# EAGLE design numpad (EAGLE 9.6.2)
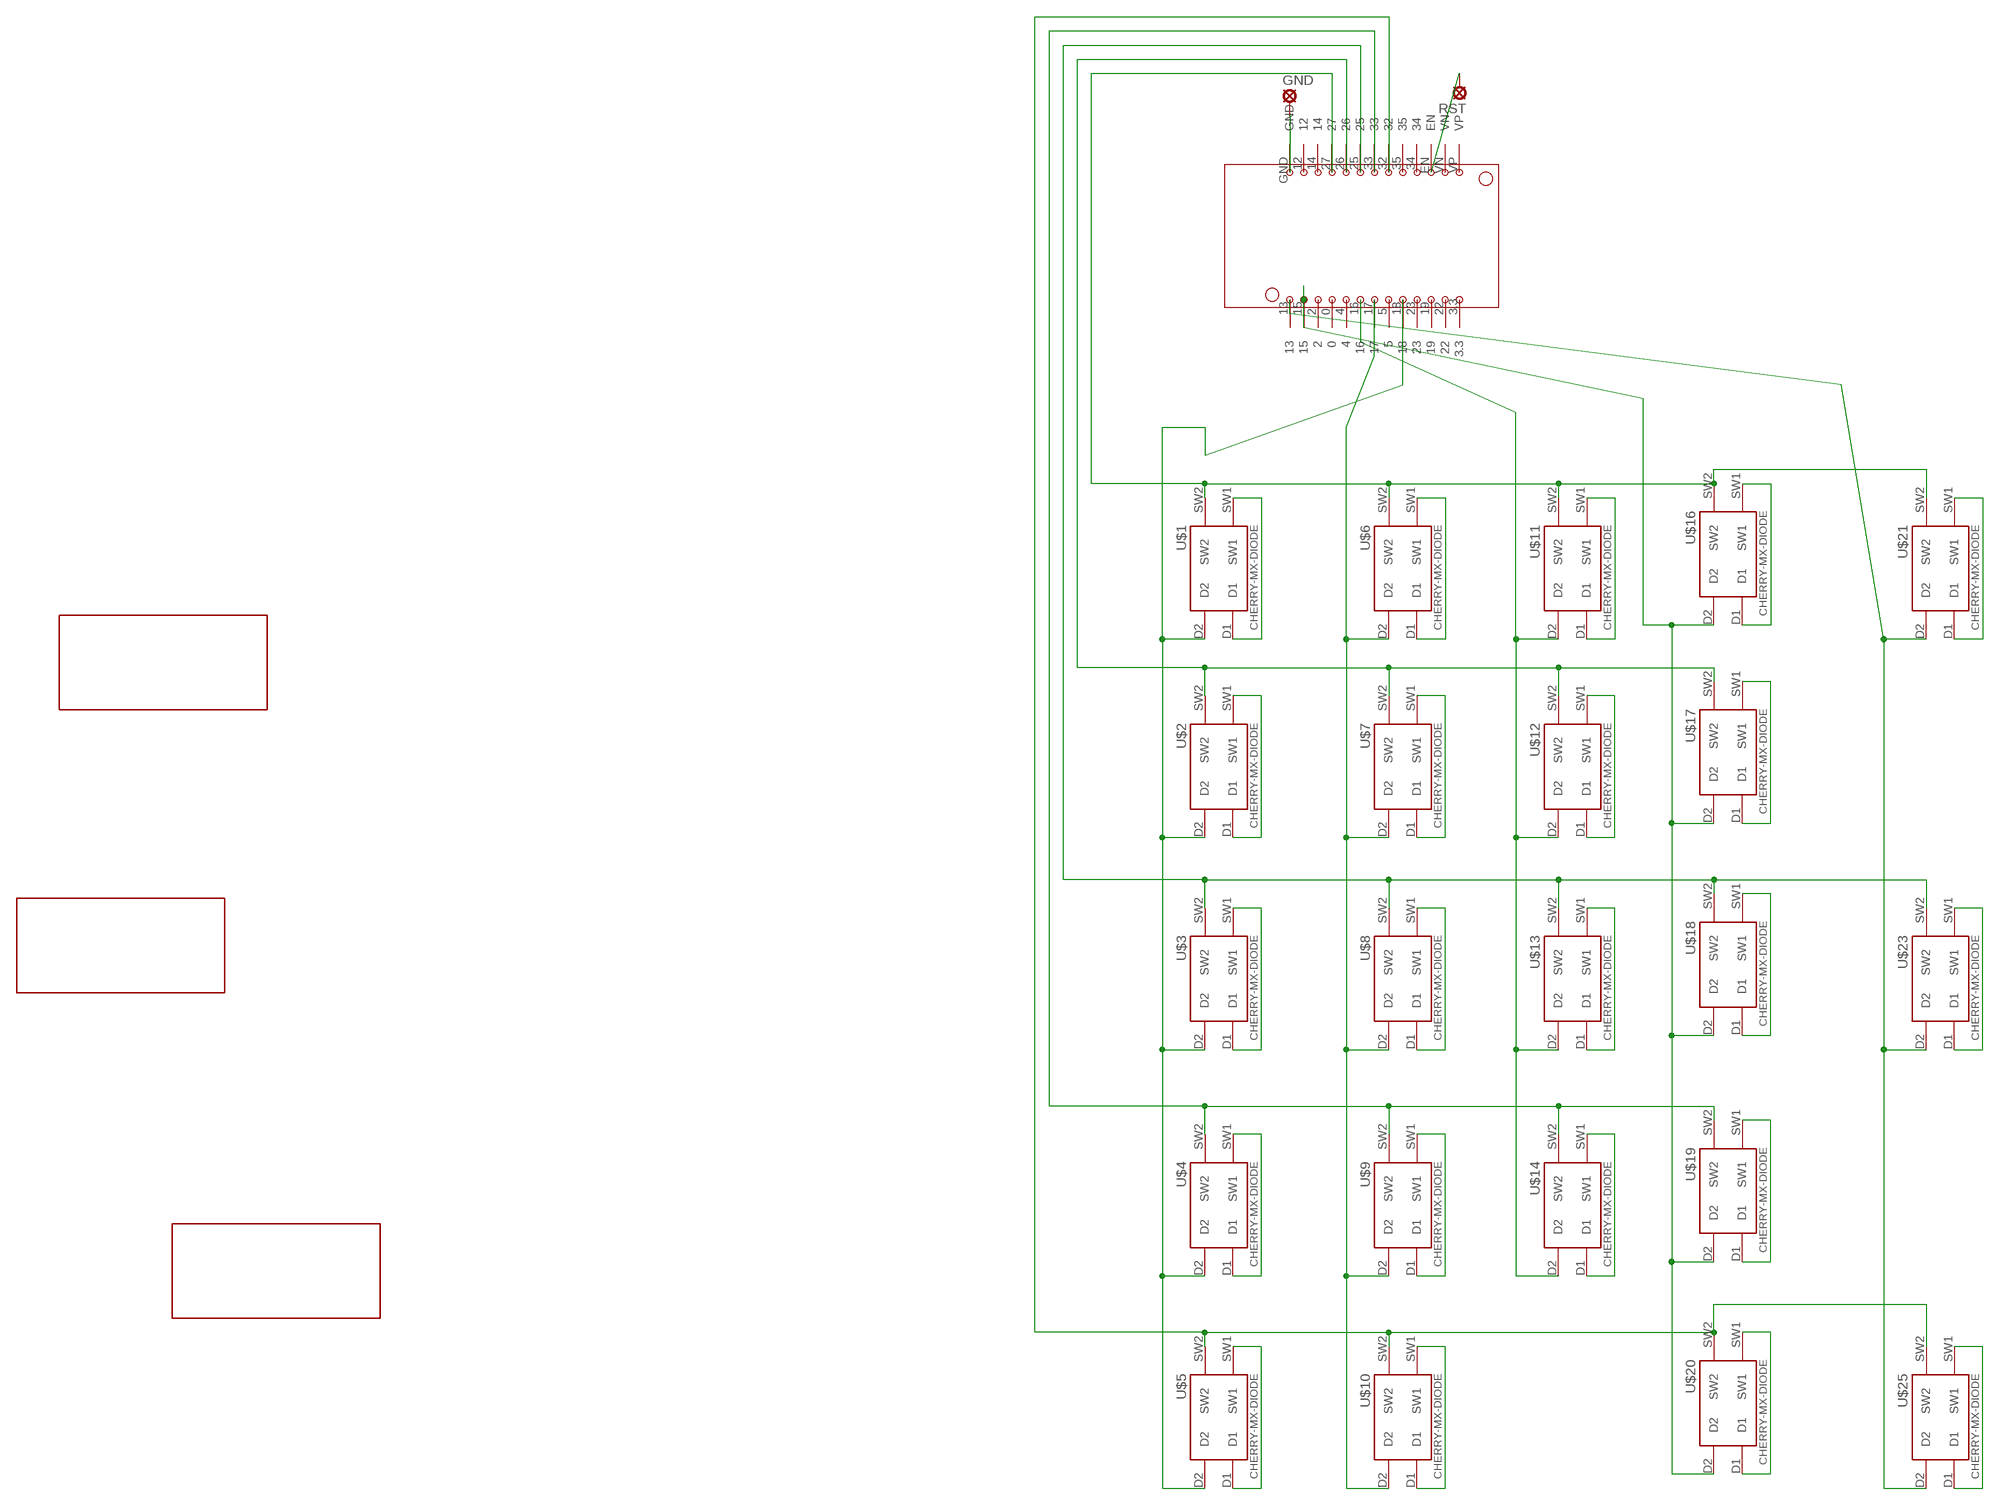
[diagram p0: schematic, sheet 1]

## Parts
GND  LSP10  [LSP10]
RST  LSP10  [LSP10]
U$1  CHERRY-MX-DIODE  [CHERRY-MX-DIODE]
U$2  CHERRY-MX-DIODE  [CHERRY-MX-DIODE]
U$3  CHERRY-MX-DIODE  [CHERRY-MX-DIODE]
U$4  CHERRY-MX-DIODE  [CHERRY-MX-DIODE]
U$5  CHERRY-MX-DIODE  [CHERRY-MX-DIODE]
U$6  CHERRY-MX-DIODE  [CHERRY-MX-DIODE]
U$7  CHERRY-MX-DIODE  [CHERRY-MX-DIODE]
U$8  CHERRY-MX-DIODE  [CHERRY-MX-DIODE]
U$9  CHERRY-MX-DIODE  [CHERRY-MX-DIODE]
U$10  CHERRY-MX-DIODE  [CHERRY-MX-DIODE]
U$11  CHERRY-MX-DIODE  [CHERRY-MX-DIODE]
U$12  CHERRY-MX-DIODE  [CHERRY-MX-DIODE]
U$13  CHERRY-MX-DIODE  [CHERRY-MX-DIODE]
U$14  CHERRY-MX-DIODE  [CHERRY-MX-DIODE]
U$15  2U  [2U]
U$16  CHERRY-MX-DIODE  [CHERRY-MX-DIODE]
U$17  CHERRY-MX-DIODE  [CHERRY-MX-DIODE]
U$18  CHERRY-MX-DIODE  [CHERRY-MX-DIODE]
U$19  CHERRY-MX-DIODE  [CHERRY-MX-DIODE]
U$20  CHERRY-MX-DIODE  [CHERRY-MX-DIODE]
U$21  CHERRY-MX-DIODE  [CHERRY-MX-DIODE]
U$22  2U  [2U]
U$23  CHERRY-MX-DIODE  [CHERRY-MX-DIODE]
U$24  2U  [2U]
U$25  CHERRY-MX-DIODE  [CHERRY-MX-DIODE]
U$27  ESP32OFFBRAND  [ESP32OFFBRAND]

## Nets
N$1: U$1.D1 U$1.SW1
N$2: U$2.D1 U$2.SW1
N$3: U$3.D1 U$3.SW1
N$4: U$4.D1 U$4.SW1
N$5: U$5.D1 U$5.SW1
N$6: U$6.D1 U$6.SW1
N$7: U$7.D1 U$7.SW1
N$8: U$8.D1 U$8.SW1
N$9: U$9.D1 U$9.SW1
N$10: U$10.D1 U$10.SW1
N$11: U$6.D2 U$7.D2 U$8.D2 U$9.D2 U$10.D2 U$27.17
N$12: U$11.D1 U$11.SW1
N$13: U$12.D1 U$12.SW1
N$14: U$13.D1 U$13.SW1
N$15: U$14.D1 U$14.SW1
N$17: U$11.D2 U$12.D2 U$13.D2 U$14.D2 U$27.16
N$18: U$16.D1 U$16.SW1
N$19: U$17.D1 U$17.SW1
N$20: U$18.D1 U$18.SW1
N$21: U$19.D1 U$19.SW1
N$22: U$20.D1 U$20.SW1
N$23: U$16.D2 U$17.D2 U$18.D2 U$19.D2 U$20.D2 U$27.15
N$24: U$21.D1 U$21.SW1
N$26: U$23.D1 U$23.SW1
N$28: U$25.D1 U$25.SW1
N$29: U$21.D2 U$23.D2 U$25.D2 U$27.13
N$30: U$1.SW2 U$6.SW2 U$11.SW2 U$16.SW2 U$21.SW2 U$27.27
N$31: U$2.SW2 U$7.SW2 U$12.SW2 U$17.SW2 U$27.26
N$32: U$3.SW2 U$8.SW2 U$13.SW2 U$18.SW2 U$23.SW2 U$27.25
N$33: U$4.SW2 U$9.SW2 U$14.SW2 U$19.SW2 U$27.33
N$34: U$5.SW2 U$10.SW2 U$20.SW2 U$25.SW2 U$27.32
N$36: U$1.D2 U$2.D2 U$3.D2 U$4.D2 U$5.D2 U$27.18
N$38: GND.MP U$27.GND
N$39: RST.MP U$27.EN
Unconnected: U$27.0 U$27.2 U$27.3.3 U$27.4 U$27.5 U$27.12 U$27.14 U$27.19 U$27.22 U$27.23 U$27.34 U$27.35 U$27.VN U$27.VP

## Library data of the parts
GND RST = solpad:LSP10: SOLDER PAD drill 1.0 mm, distributor Buerklin, 12H555
U$1-U$14 U$16-U$21 U$23 U$25 = cherrymx:CHERRY-MX-DIODE: Cherry MX series keyswitch with diode bridge
U$15 U$22 U$24 = Cherry 2u stab:2U
U$27 = ESP32:ESP32OFFBRAND

## Board
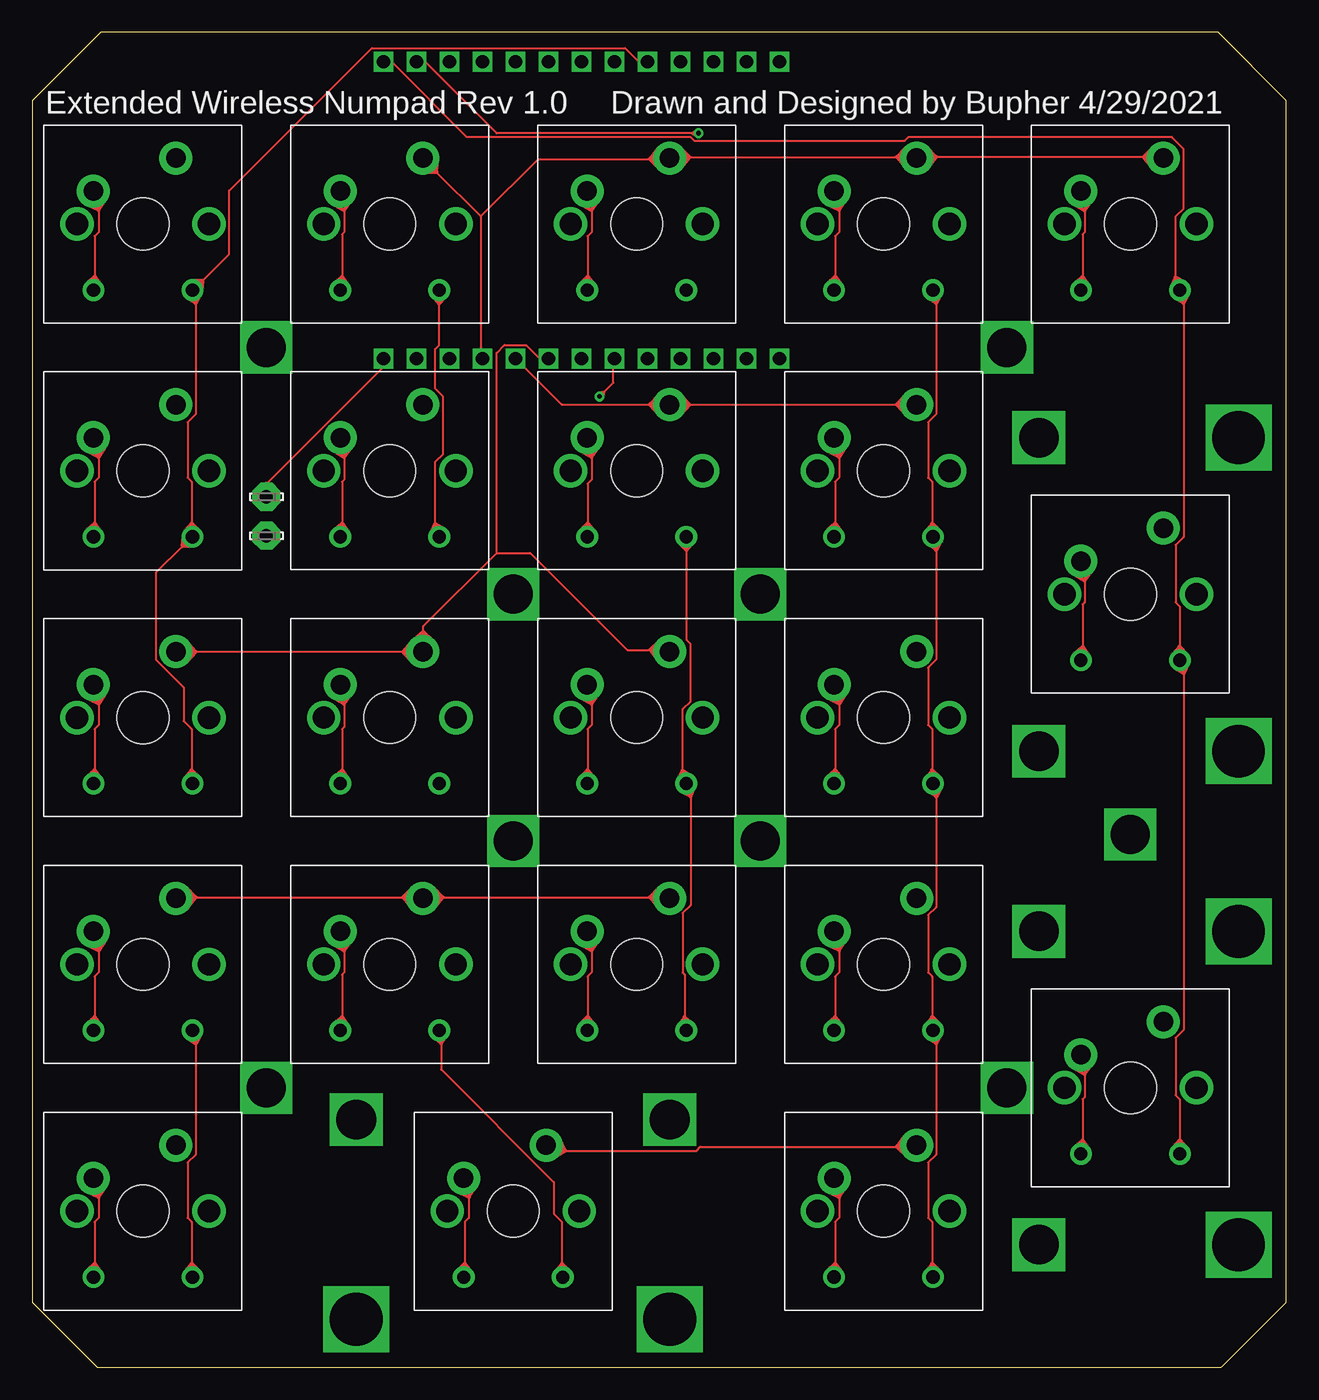
[diagram p1: board, top side]
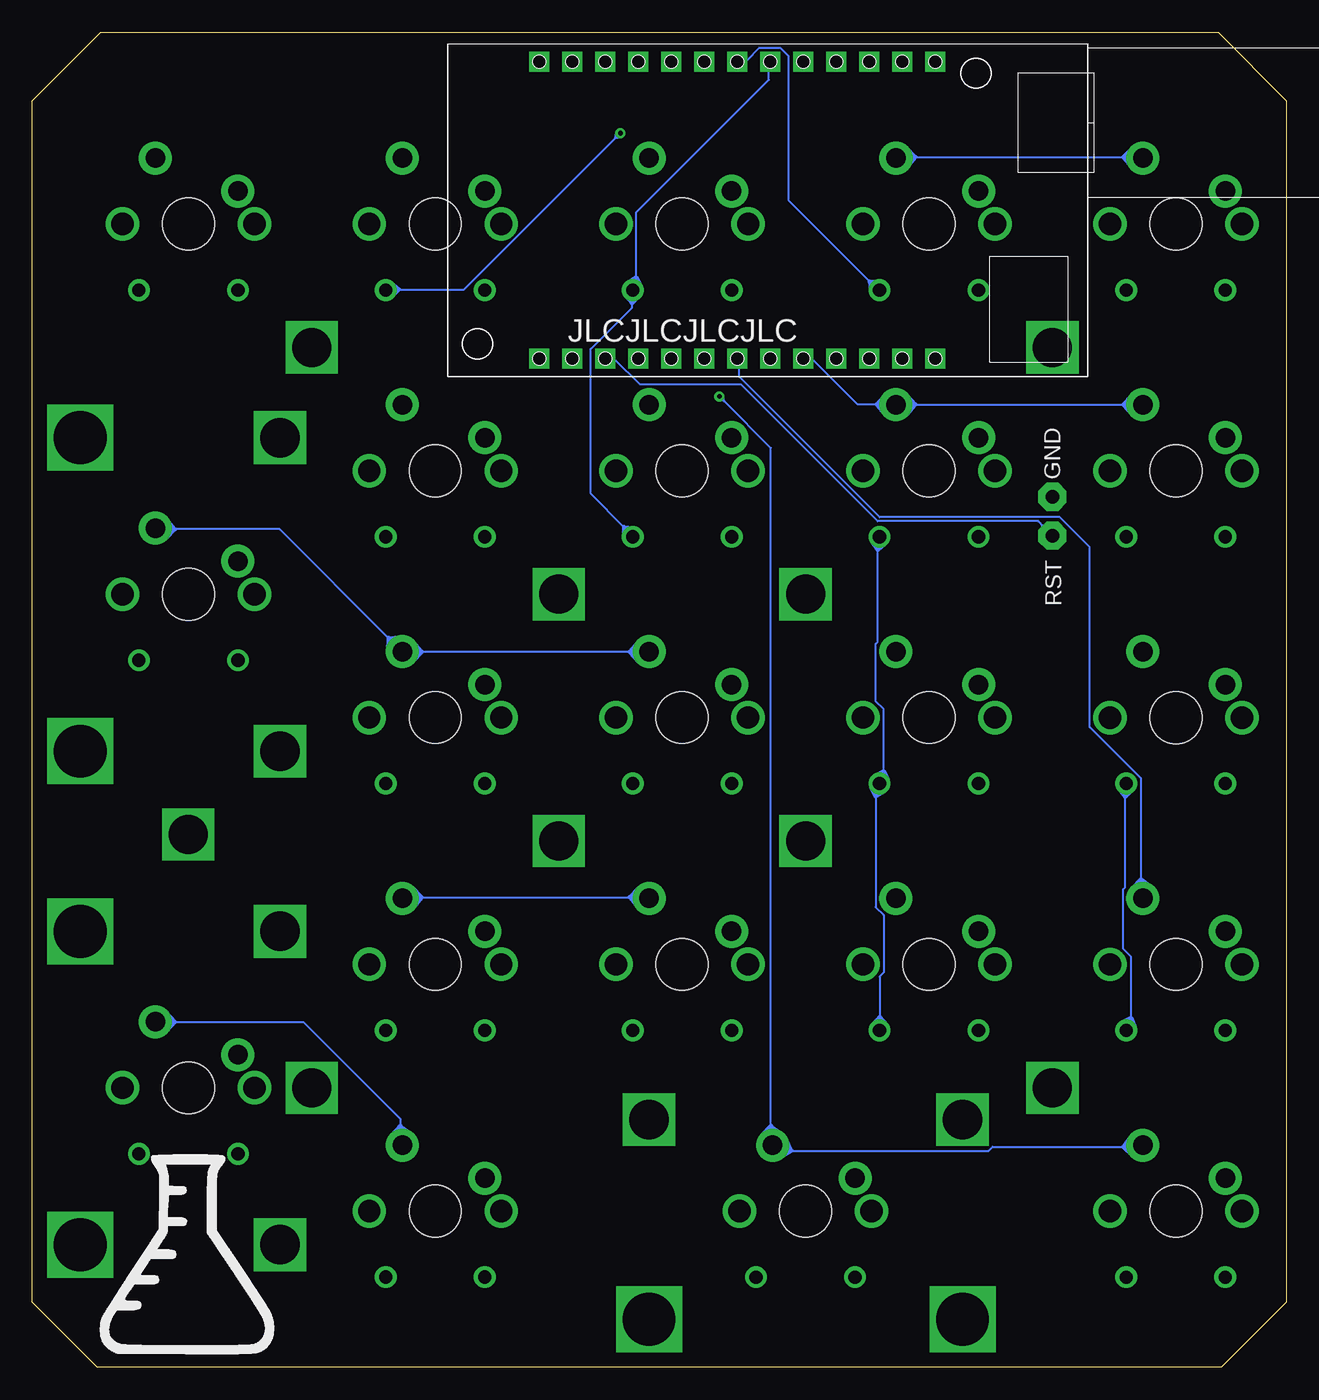
[diagram p2: board, bottom side, seen from below]

Size 96.5 x 102.75 mm. Coordinates in mm from the lower left corner, seen from the top.
Outline: 5,0 91.5,0 96.5,5 96.5,97.5 91.25,102.75 5.25,102.75 0,97.5 0,5 5,0
Copper layers (1*16): Top 0.035mm / dielectric 1.5mm / Bottom 0.035mm
Design rules "default": minimum track width 6mil, minimum drill 0.35mm, track to track 6mil, track to pad 6mil, pad to pad 6mil, via to via 6mil, smd to smd 6mil, copper to edge 40mil, drill to drill 6mil, minimum pad ring 10mil, minimum via ring 8mil, stop-mask expansion 4mil, vias tented up to drill 0mil, thermal gap 10mil

### Footprints (pad centres in the part's own frame; a part is rotated, then mirrored left to right if it is on the bottom)
LSP10 = drill 1.016 pad 2.159 octagon: MP 0,0
CHERRY-MX-DIODE = drill 1.016 pad 1.676: D1 -3.81,-5.08; D2 3.81,-5.08 | drill 1.714 pad 1.93: P$3 -5.08,0; P$4 5.08,0 | drill 1.5 pad 2.54: SW1 -3.81,2.54; SW2 2.54,5.08 | hole 4: 0,0
2U = drill 3.048 square: P$1 -12.082,7.044; P$3 12.048,7.044 | drill 4.064 square: P$2 -12.082,-8.323; P$4 12.048,-8.323
ESP32OFFBRAND = drill 1.016 square: 0 0,22.86; 2 0,25.4; 3.3 0,0; 4 0,20.32; 5 0,12.7; 12 22.86,27.94; 13 0,30.48; 14 22.86,25.4; 15 0,27.94; 16 0,17.78; 17 0,15.24; 18 0,10.16; 19 0,5.08; 22 0,2.54; 23 0,7.62; 25 22.86,17.78; 26 22.86,20.32; 27 22.86,22.86; 32 22.86,12.7; 33 22.86,15.24; 34 22.86,7.62; 35 22.86,10.16; EN 22.86,5.08; GND 22.86,30.48; VN 22.86,2.54; VP 22.86,0

### Placement (x,y rotation side)
GND  18,67 0 top
RST  18,64 0 top
U$1  8.5,88 0 top
U$2  8.5,69 0 top
U$3  8.5,50 0 top
U$4  8.5,31 0 top
U$5  8.5,12 0 top
U$6  27.5,88 0 top
U$7  27.5,69 0 top
U$8  27.5,50 0 top
U$9  27.5,31.01 0 top
U$10  37,12 0 top
U$11  46.5,88 0 top
U$12  46.5,69 0 top
U$13  46.5,50 0 top
U$14  46.5,31.01 0 top
U$15  37,12 0 top
U$16  65.5,88 0 top
U$17  65.5,69 0 top
U$18  65.5,50 0 top
U$19  65.5,31.01 0 top
U$20  65.5,12 0 top
U$21  84.5,88 0 top
U$22  84.5,21.5 90 top
U$23  84.5,59.5 0 top
U$24  84.5,59.5 90 top
U$25  84.5,21.5 0 top
U$27  57.5,100.5 270 bottom

### Tracks (layer width: path | path; a pad name or v marks a point on that pad's centre or on a via)
N$1
  Top 0.152: U$1.D1 4.78,82.95 4.78,83.93 4.78,87.07 5.08,87.37 5.08,89.09 5.08,90.12 4.78,90.42 U$1.SW1
  Top 0.305: 5.08,89.09 5.63,89.93 U$1.SW1 4.19,89.54 5.08,89.09 | 4.78,83.93 4.23,83.42 U$1.D1 5.23,83.34 4.78,83.93
N$2
  Top 0.152: U$2.D1 4.78,64.06 4.78,64.93 4.78,68.17 5.08,68.48 5.08,70.09 5.08,71.22 4.78,71.52 U$2.SW1
  Top 0.305: 4.78,64.93 4.23,64.42 U$2.D1 5.23,64.34 4.78,64.93 | 5.08,70.09 5.63,70.93 U$2.SW1 4.19,70.54 5.08,70.09
N$3
  Top 0.152: U$3.D1 4.78,45.01 4.78,45.93 4.78,49.12 5.08,49.43 5.08,51.09 5.08,52.17 4.78,52.47 U$3.SW1
  Top 0.305: 4.78,45.93 4.23,45.42 U$3.D1 5.23,45.34 4.78,45.93 | 5.08,51.09 5.63,51.93 U$3.SW1 4.19,51.54 5.08,51.09
N$4
  Top 0.152: U$4.D1 4.78,25.96 4.78,26.93 4.78,30.07 5.08,30.38 5.08,32.09 5.08,33.12 4.78,33.42 U$4.SW1
  Top 0.305: 4.78,26.93 4.23,26.43 U$4.D1 5.23,26.34 4.78,26.93 | 5.08,32.09 5.63,32.93 U$4.SW1 4.19,32.54 5.08,32.09
N$5
  Top 0.152: U$5.D1 4.78,7.06 4.78,7.93 4.78,11.17 5.08,11.48 5.08,13.09 5.08,14.22 4.78,14.53 U$5.SW1
  Top 0.305: 4.78,7.93 4.23,7.43 U$5.D1 5.23,7.34 4.78,7.93 | 5.08,13.09 5.63,13.93 U$5.SW1 4.19,13.54 5.08,13.09
N$6
  Top 0.152: U$6.D1 23.83,82.95 23.83,83.93 23.83,87.22 23.98,87.37 23.98,89.07 23.98,90.27 23.83,90.42 U$6.SW1
  Top 0.305: 23.98,89.07 24.58,89.87 U$6.SW1 23.12,89.58 23.98,89.07 | 23.83,83.93 23.25,83.45 U$6.D1 24.25,83.31 23.83,83.93
N$7
  Top 0.152: U$7.D1 23.83,64.06 23.83,64.93 23.83,68.17 23.98,68.32 23.98,70.07 23.98,71.37 23.83,71.52 U$7.SW1
  Top 0.305: 23.83,64.93 23.25,64.45 U$7.D1 24.25,64.31 23.83,64.93 | 23.98,70.07 24.58,70.87 U$7.SW1 23.12,70.58 23.98,70.07
N$8
  Top 0.152: U$8.D1 23.83,45.01 23.83,45.93 23.83,49.12 23.98,49.27 23.98,51.07 23.98,52.32 23.83,52.47 U$8.SW1
  Top 0.305: 23.83,45.93 23.25,45.45 U$8.D1 24.25,45.31 23.83,45.93 | 23.98,51.07 24.58,51.87 U$8.SW1 23.12,51.58 23.98,51.07
N$9
  Top 0.152: U$9.D1 23.83,25.96 23.83,26.93 23.83,30.22 23.98,30.38 23.98,32.07 23.98,33.27 23.83,33.42 U$9.SW1
  Top 0.305: 23.83,26.93 23.25,26.45 U$9.D1 24.25,26.32 23.83,26.93 | 23.98,32.07 24.58,32.87 U$9.SW1 23.12,32.59 23.98,32.07
N$10
  Top 0.152: U$10.D1 33.28,7.06 33.28,7.93 33.28,11.17 33.58,11.48 33.58,13.09 33.58,14.22 33.28,14.53 U$10.SW1
  Top 0.305: 33.28,7.93 32.73,7.42 U$10.D1 33.73,7.34 33.28,7.93 | 33.58,13.09 34.13,13.93 U$10.SW1 32.69,13.54 33.58,13.09
N$11
  Top 0.152: U$10.D2 40.74,7.06 40.74,7.93 40.74,11.17 40.13,11.78 40.13,14.22 31.45,22.91 31.45,24.92 31.45,25.8 U$9.D2 | U$6.D2 31.3,82.8 31.3,81.9 31.3,78.69 30.99,78.38 30.99,75.33 31.6,74.72 31.6,70.3 30.99,69.69 30.99,64.89 30.99,64.36 31.3,64.06 U$7.D2
  Top 0.305: 31.3,81.9 31.81,82.45 U$6.D2 30.8,82.47 31.3,81.9 | 30.99,64.89 30.68,64.2 U$7.D2 31.65,64.52 30.99,64.89 | 31.45,24.92 31.87,25.54 U$9.D2 30.87,25.4 31.45,24.92 | 40.74,7.93 40.27,7.35 U$10.D2 41.28,7.41 40.74,7.93
  Bottom 0.152: U$27.17 42.12,100.63 41.51,100.63 40.59,101.55 38.91,101.55 38.31,100.94 38.31,89.81 32.08,83.58 31.45,82.95 U$6.D2 | U$9.D2 31.3,25.96 31.3,26.94 31.3,30.07 30.99,30.38 30.99,34.8 31.6,35.41 31.6,43.95 31.6,44.7 31.45,44.85 U$8.D2 31.3,45.01 30.99,45.31 30.99,45.88 30.99,50.65 31.6,51.25 31.6,55.67 31.45,55.83 31.45,62.92 31.45,63.9 U$7.D2
  Bottom 0.305: U$8.D2 31.93,44.62 31.6,43.95 30.96,44.33 U$8.D2 | U$8.D2 30.68,45.2 30.99,45.88 31.65,45.52 U$8.D2 | 32.08,83.58 31.33,83.61 U$6.D2 31.99,82.84 32.08,83.58 | 31.45,62.92 31.87,63.53 U$7.D2 30.87,63.4 31.45,62.92 | 31.3,26.94 30.8,26.38 U$9.D2 31.81,26.4 31.3,26.94
N$12
  Top 0.152: U$11.D1 42.73,82.95 42.73,83.94 42.73,87.07 43.03,87.37 43.03,89.08 43.03,90.12 42.73,90.42 U$11.SW1
  Top 0.305: 43.03,89.08 43.6,89.9 U$11.SW1 42.15,89.56 43.03,89.08 | 42.73,83.94 42.2,83.4 U$11.D1 43.21,83.36 42.73,83.94
N$13
  Top 0.152: U$12.D1 42.73,64.06 42.73,64.94 42.73,68.02 43.03,68.32 43.03,70.08 43.03,71.22 42.73,71.52 U$12.SW1
  Top 0.305: 42.73,64.94 42.2,64.4 U$12.D1 43.21,64.37 42.73,64.94 | 43.03,70.08 43.6,70.9 U$12.SW1 42.15,70.56 43.03,70.08
N$14
  Top 0.152: U$13.D1 42.73,45.01 42.73,45.94 42.73,49.12 43.03,49.43 43.03,51.08 43.03,52.17 42.73,52.47 U$13.SW1
  Top 0.305: 42.73,45.94 42.2,45.4 U$13.D1 43.21,45.37 42.73,45.94 | 43.03,51.08 43.6,51.9 U$13.SW1 42.15,51.56 43.03,51.08
N$15
  Top 0.152: U$14.D1 42.73,25.96 42.73,26.94 42.73,30.07 43.03,30.38 43.03,32.09 43.03,33.12 42.73,33.42 U$14.SW1
  Top 0.305: 42.73,26.94 42.2,26.41 U$14.D1 43.21,26.37 42.73,26.94 | 43.03,32.09 43.6,32.9 U$14.SW1 42.15,32.57 43.03,32.09
N$16  (via drill 3)
  other vias: 18,21.5
N$17
  Top 0.152: U$14.D2 50.19,25.96 50.19,26.93 50.19,30.22 50.04,30.38 50.04,34.95 50.65,35.56 50.65,43.96 50.65,44.55 50.34,44.85 U$13.D2 50.19,45.01 50.04,45.16 50.04,45.9 50.04,50.65 50.65,51.25 50.65,55.67 50.34,55.98 50.34,62.91 50.34,63.9 U$12.D2
  Top 0.305: U$13.D2 50.94,44.65 50.65,43.96 49.99,44.31 U$13.D2 | U$13.D2 49.7,45.23 50.04,45.9 50.67,45.5 U$13.D2 | 50.34,62.91 50.83,63.48 U$12.D2 49.82,63.44 50.34,62.91 | 50.19,26.93 49.75,26.33 U$14.D2 50.76,26.44 50.19,26.93
  Bottom 0.152: U$27.16 39.83,100.48 39.83,99.11 50.04,88.9 50.04,83.9 50.04,83.11 50.19,82.95 U$11.D2 50.34,82.8 50.34,81.91 50.34,81.58 53.55,78.38 53.55,67.26 50.98,64.69 50.34,64.06 U$12.D2
  Bottom 0.305: U$11.D2 49.7,83.23 50.04,83.9 50.67,83.5 U$11.D2 | U$11.D2 50.83,82.47 50.34,81.91 49.82,82.44 U$11.D2 | 50.98,64.69 50.23,64.61 U$12.D2 51,63.94 50.98,64.69
N$18
  Top 0.152: U$16.D1 61.78,82.95 61.78,83.93 61.78,87.07 62.08,87.37 62.08,89.09 62.08,90.12 61.78,90.42 U$16.SW1
  Top 0.305: 62.08,89.09 62.63,89.93 U$16.SW1 61.19,89.54 62.08,89.09 | 61.78,83.93 61.22,83.42 U$16.D1 62.23,83.34 61.78,83.93
N$19
  Top 0.152: U$17.D1 61.78,64.06 61.78,64.94 61.78,68.17 62.08,68.48 62.08,70.09 62.08,71.22 61.78,71.52 U$17.SW1
  Top 0.305: 61.78,64.94 61.22,64.43 U$17.D1 62.23,64.34 61.78,64.94 | 62.08,70.09 62.63,70.93 U$17.SW1 61.19,70.55 62.08,70.09
N$20
  Top 0.152: U$18.D1 61.78,45.01 61.78,45.93 61.78,49.12 62.08,49.43 62.08,51.09 62.08,52.17 61.78,52.47 U$18.SW1
  Top 0.305: 61.78,45.93 61.22,45.42 U$18.D1 62.23,45.34 61.78,45.93 | 62.08,51.09 62.63,51.93 U$18.SW1 61.19,51.54 62.08,51.09
N$21
  Top 0.152: U$19.D1 61.78,25.96 61.78,26.94 61.78,30.07 62.08,30.38 62.08,32.1 62.08,33.12 61.78,33.42 U$19.SW1
  Top 0.305: 61.78,26.94 61.22,26.43 U$19.D1 62.23,26.34 61.78,26.94 | 62.08,32.1 62.63,32.94 U$19.SW1 61.19,32.55 62.08,32.1
N$22
  Top 0.152: U$20.D1 61.78,7.06 61.78,7.93 61.78,11.17 62.08,11.48 62.08,13.09 62.08,14.22 61.78,14.53 U$20.SW1
  Top 0.305: 61.78,7.93 61.22,7.43 U$20.D1 62.23,7.34 61.78,7.93 | 62.08,13.09 62.63,13.93 U$20.SW1 61.19,13.54 62.08,13.09
N$23  (via drill 0.35)
  Top 0.152: U$20.D2 69.24,7.06 69.24,7.94 69.24,11.17 68.94,11.48 68.94,15.75 69.55,16.36 69.55,24.94 69.55,25.65 69.39,25.8 U$19.D2 69.24,25.96 69.24,26.94 69.24,30.07 68.94,30.38 68.94,34.8 69.55,35.41 69.55,43.93 69.55,44.7 69.39,44.85 U$18.D2 69.24,45.01 69.24,45.94 69.24,49.12 68.94,49.43 68.94,53.84 69.55,54.45 69.55,62.94 69.55,63.75 69.39,63.9 U$17.D2 69.24,64.06 69.24,64.94 69.24,68.17 68.94,68.48 68.94,72.74 69.55,73.35 69.55,81.93 69.55,82.65 69.39,82.8 U$16.D2 | v51.26,94.99 50.73,94.99 | 50.73,94.99 35.72,94.99 30.23,100.48 29.62,100.48 U$27.15 | 50.73,94.99 51.09,94.75 v51.26,94.99 | 50.73,94.99 51.09,95.24 v51.26,94.99
  Top 0.305: U$17.D2 69.91,63.59 69.55,62.94 68.93,63.36 U$17.D2 | U$17.D2 68.78,64.35 69.24,64.94 69.78,64.42 U$17.D2 | U$18.D2 68.78,45.35 69.24,45.94 69.78,45.42 U$18.D2 | U$18.D2 69.91,44.59 69.55,43.93 68.93,44.35 U$18.D2 | U$19.D2 69.91,25.59 69.55,24.94 68.93,25.36 U$19.D2 | U$19.D2 68.78,26.35 69.24,26.94 69.78,26.42 U$19.D2 | 69.55,81.93 69.91,82.59 U$16.D2 68.93,82.35 69.55,81.93 | 69.24,7.94 68.78,7.35 U$20.D2 69.78,7.42 69.24,7.94
  Bottom 0.152: 51.63,94.62 63.3,82.95 68.3,82.95 69.24,82.95 U$16.D2 | 51.63,94.62 v51.26,94.99 | 51.63,94.62 51.56,95.05 v51.26,94.99 | 51.63,94.62 51.21,94.7 v51.26,94.99
  Bottom 0.305: 68.3,82.95 68.83,82.43 U$16.D2 68.86,83.44 68.3,82.95
N$24
  Top 0.152: U$21.D1 80.83,82.95 80.83,83.93 80.83,87.22 80.98,87.37 80.98,89.07 80.98,90.27 80.83,90.42 U$21.SW1
  Top 0.305: 80.98,89.07 81.58,89.87 U$21.SW1 80.12,89.58 80.98,89.07 | 80.83,83.93 80.25,83.45 U$21.D1 81.25,83.31 80.83,83.93
N$25  (via drill 3)
  other vias: 75,21.5
N$26
  Top 0.152: U$23.D1 80.83,54.45 80.83,55.43 80.83,58.72 80.98,58.87 80.98,60.57 80.98,61.77 80.83,61.92 U$23.SW1
  Top 0.305: 80.83,55.43 80.25,54.95 U$23.D1 81.25,54.81 80.83,55.43 | 80.98,60.57 81.58,61.37 U$23.SW1 80.12,61.08 80.98,60.57
N$27  (via drill 3)
  other vias: 75,78.5
N$28
  Top 0.152: U$25.D1 80.83,16.51 80.83,17.43 80.83,20.62 80.98,20.77 80.98,22.57 80.98,23.82 80.83,23.98 U$25.SW1
  Top 0.305: 80.83,17.43 80.25,16.95 U$25.D1 81.25,16.81 80.83,17.43 | 80.98,22.57 81.58,23.37 U$25.SW1 80.12,23.08 80.98,22.57
N$29
  Top 0.152: U$25.D2 88.29,16.51 88.29,17.44 88.29,20.62 87.99,20.93 87.99,25.35 88.6,25.96 88.6,53.45 88.6,54.15 88.44,54.3 U$23.D2 88.29,54.45 88.29,55.44 88.29,58.57 87.99,58.87 87.99,63.29 88.6,63.9 88.6,81.95 88.6,82.65 88.44,82.8 U$21.D2 88.29,82.95 87.99,83.26 87.99,83.88 87.99,88.59 88.6,89.2 88.6,93.77 87.68,94.69 67.41,94.69 67.11,94.38 50.95,94.38 50.65,94.69 33.43,94.69 27.64,100.48 27.03,100.48 U$27.13
  Top 0.305: U$21.D2 87.68,83.2 87.99,83.88 88.64,83.52 U$21.D2 | U$21.D2 88.93,82.62 88.6,81.95 87.96,82.33 U$21.D2 | U$23.D2 88.93,54.12 88.6,53.45 87.96,53.83 U$23.D2 | U$23.D2 87.8,54.87 88.29,55.44 88.81,54.89 U$23.D2 | 88.29,17.44 87.8,16.87 U$25.D2 88.81,16.89 88.29,17.44
N$30
  Top 0.152: U$21.SW2 86.92,93.16 85.54,93.16 69.54,93.16 68.18,93.16 U$16.SW2 68.02,93.16 66.54,93.16 50.54,93.16 49.13,93.16 U$11.SW2 48.97,93.01 47.54,93.01 38.91,93.01 34.5,88.59 | 34.5,88.59 34.5,77.77 U$27.27 | 34.5,88.59 31.09,92 30.08,93.01 U$6.SW2
  Top 0.305: U$11.SW2 48.24,92.3 47.54,93.01 48.17,93.79 U$11.SW2 | U$11.SW2 49.83,93.87 50.54,93.16 49.91,92.38 U$11.SW2 | U$16.SW2 68.83,93.87 69.54,93.16 68.91,92.38 U$16.SW2 | U$16.SW2 67.17,92.38 66.54,93.16 67.25,93.87 U$16.SW2 | 31.09,92 31.16,93 U$6.SW2 30.09,91.96 31.09,92 | 85.54,93.16 86.17,92.38 U$21.SW2 86.25,93.87 85.54,93.16
  Bottom 0.152: U$1.SW2 11.18,93.16 12.54,93.16 28.54,93.16 29.92,93.16 U$6.SW2
  Bottom 0.305: 12.54,93.16 11.83,93.87 U$1.SW2 11.91,92.38 12.54,93.16 | 28.54,93.16 29.17,92.38 U$6.SW2 29.25,93.87 28.54,93.16
N$31
  Top 0.152: U$27.26 37.24,77.62 40.74,74.11 47.54,74.11 48.97,74.11 U$12.SW2 49.13,74.11 50.54,74.11 66.54,74.11 68.02,74.11 U$17.SW2
  Top 0.305: U$12.SW2 48.19,73.36 47.54,74.11 48.22,74.85 U$12.SW2 | U$12.SW2 49.86,74.85 50.54,74.11 49.89,73.36 U$12.SW2 | 66.54,74.11 67.19,73.36 U$17.SW2 67.22,74.85 66.54,74.11
  Bottom 0.152: U$27.26 37.09,77.62 36.48,77.62 32.97,74.11 31.54,74.11 30.08,74.11 U$7.SW2 29.92,74.11 28.54,74.11 12.54,74.11 11.18,74.11 U$2.SW2
  Bottom 0.305: U$7.SW2 30.86,74.85 31.54,74.11 30.89,73.36 U$7.SW2 | U$7.SW2 29.19,73.36 28.54,74.11 29.22,74.85 U$7.SW2 | 12.54,74.11 11.86,74.84 U$2.SW2 11.89,73.35 12.54,74.11
N$32
  Top 0.152: 35.72,62.68 35.72,78.08 36.32,78.69 38,78.69 38.91,77.77 39.68,77.77 U$27.25 | 35.72,62.68 30.08,57.05 30.08,56.58 30.08,55.22 U$8.SW2 29.92,55.06 28.54,55.06 12.54,55.06 11.18,55.06 U$3.SW2 | 35.72,62.68 38.31,62.68 45.77,55.22 47.55,55.22 48.97,55.22 U$13.SW2
  Top 0.305: U$8.SW2 29.31,55.93 30.08,56.58 30.8,55.9 U$8.SW2 | U$8.SW2 29.22,54.33 28.54,55.06 29.2,55.82 U$8.SW2 | 12.54,55.06 11.88,55.82 U$3.SW2 11.86,54.33 12.54,55.06 | 47.55,55.22 48.14,54.41 U$13.SW2 48.28,55.9 47.55,55.22
  Bottom 0.152: U$13.SW2 49.13,55.06 50.54,55.06 66.54,55.06 68.02,55.06 U$18.SW2 68.18,55.22 69.1,56.14 77.47,64.51 85.54,64.51 86.92,64.51 U$23.SW2
  Bottom 0.305: U$18.SW2 67.22,54.33 66.54,55.06 67.2,55.82 U$18.SW2 | U$18.SW2 68.1,56.2 69.1,56.14 69.16,55.14 U$18.SW2 | 50.54,55.06 49.88,55.82 U$13.SW2 49.87,54.33 50.54,55.06 | 85.54,64.51 86.24,63.8 U$23.SW2 86.17,65.29 85.54,64.51
N$33
  Top 0.152: U$4.SW2 11.18,36.17 12.54,36.17 28.54,36.17 29.92,36.17 U$9.SW2 30.08,36.17 31.54,36.17 47.54,36.17 48.97,36.17 U$14.SW2
  Top 0.305: U$9.SW2 29.17,35.39 28.54,36.17 29.25,36.88 U$9.SW2 | U$9.SW2 30.83,36.88 31.54,36.17 30.91,35.39 U$9.SW2 | 12.54,36.17 11.83,36.87 U$4.SW2 11.91,35.38 12.54,36.17 | 47.54,36.17 48.17,35.39 U$14.SW2 48.25,36.88 47.54,36.17
  Bottom 0.152: U$14.SW2 49.13,36.17 50.54,36.17 66.54,36.17 68.02,36.17 U$19.SW2 | U$27.33 42.12,77.62 42.12,76.25 31.3,65.43 17.43,65.43 15.14,63.14 15.14,49.27 11.18,45.31 11.18,37.57 11.18,36.17 U$4.SW2
  Bottom 0.305: 11.18,37.57 10.38,36.98 U$4.SW2 11.86,36.84 11.18,37.57 | 50.54,36.17 49.83,36.88 U$14.SW2 49.91,35.39 50.54,36.17 | 66.54,36.17 67.17,35.39 U$19.SW2 67.25,36.88 66.54,36.17
N$34  (via drill 0.35)
  Top 0.152: v43.64,74.72 44.01,75.09 | 44.01,75.09 44.71,75.79 44.71,77.62 U$27.32 | U$20.SW2 68.02,16.96 66.55,16.96 51.41,16.96 51.11,16.66 40.98,16.66 39.98,16.66 39.68,16.96 U$10.SW2 | 44.01,75.09 43.59,75.02 v43.64,74.72 | 44.01,75.09 43.94,74.67 v43.64,74.72
  Top 0.305: 40.98,16.66 40.55,17.56 U$10.SW2 40.13,16.13 40.98,16.66 | 66.55,16.96 67.27,16.27 U$20.SW2 67.15,17.76 66.55,16.96
  Bottom 0.152: U$20.SW2 68.18,17.12 68.18,18.57 68.18,19.1 75.64,26.57 85.54,26.57 86.92,26.57 U$25.SW2 | 43.27,74.35 39.68,70.76 39.68,18.57 39.68,17.12 U$10.SW2 39.52,16.96 39.22,16.66 38.1,16.66 22.91,16.66 22.61,16.96 12.54,16.96 11.18,16.96 U$5.SW2 | 43.27,74.35 v43.64,74.72 | 43.27,74.35 43.69,74.43 v43.64,74.72 | 43.27,74.35 43.34,74.78 v43.64,74.72
  Bottom 0.305: U$10.SW2 38.87,17.98 39.68,18.57 40.36,17.84 U$10.SW2 | U$10.SW2 38.95,16.13 38.1,16.66 38.53,17.56 U$10.SW2 | 12.54,16.96 11.93,17.76 U$5.SW2 11.81,16.27 12.54,16.96 | 85.54,26.57 86.22,25.83 U$25.SW2 86.2,27.32 85.54,26.57 | 68.18,18.57 67.37,17.98 U$20.SW2 68.86,17.84 68.18,18.57
N$35  (via drill 3)
  other vias: 18,78.5
N$36
  Top 0.152: U$5.D2 12.25,7.06 12.25,7.93 12.25,11.17 11.94,11.48 11.94,15.75 12.55,16.36 12.55,24.93 12.55,25.65 12.4,25.8 U$4.D2 | U$27.18 47.3,100.63 46.53,100.63 45.62,101.55 26.11,101.55 15.14,90.57 15.14,85.7 13.05,83.61 12.4,82.95 U$1.D2 12.4,82.8 12.55,82.65 12.55,81.93 12.55,73.35 11.94,72.74 11.94,68.48 12.25,68.17 12.25,64.93 12.25,64.06 U$2.D2 12.25,63.9 11.57,63.23 9.5,61.16 9.5,54.45 11.64,52.32 11.64,49.73 12.25,49.12 12.25,45.93 12.25,45.01 U$3.D2
  Top 0.305: U$1.D2 12.3,83.61 13.05,83.61 12.99,82.86 U$1.D2 | U$1.D2 12.91,82.59 12.55,81.93 11.93,82.35 U$1.D2 | U$2.D2 11.78,64.35 12.25,64.93 12.79,64.41 U$2.D2 | U$2.D2 12.32,63.23 11.57,63.23 11.63,63.97 U$2.D2 | 12.25,45.93 11.78,45.35 U$3.D2 12.79,45.41 12.25,45.93 | 12.55,24.93 12.91,25.59 U$4.D2 11.93,25.35 12.55,24.93 | 12.25,7.93 11.78,7.35 U$5.D2 12.79,7.41 12.25,7.93
  Bottom 0.152: U$3.D2 12.4,44.85 12.4,43.91 12.4,36.93 12.55,36.78 12.55,32.2 11.94,31.59 11.94,26.87 11.94,26.26 12.25,25.96 U$4.D2
  Bottom 0.305: 12.4,43.91 12.85,44.5 U$3.D2 11.85,44.41 12.4,43.91 | 11.94,26.87 11.67,26.17 U$4.D2 12.61,26.54 11.94,26.87
N$37  (via drill 3)
  other vias: 56,40.5
N$38
  Top 0.152: U$27.GND 26.88,77.62 26.88,76.86 18.04,68.02 18.04,67.1 GND.MP
  Top 0.305: 18.04,68.02 17.65,67.86 GND.MP 18.41,67.83 18.04,68.02
N$39
  Bottom 0.152: U$27.EN 52.33,77.62 51.72,77.62 49.74,75.64 41.96,75.64 31.45,65.12 19.1,65.12 18.71,64.73 18.04,64.06 RST.MP
  Bottom 0.305: 18.71,64.73 18.32,64.87 RST.MP 18.86,64.34 18.71,64.73
N$40  (via drill 3)
  other vias: 84.5,41
N$41  (via drill 3)
  other vias: 56,59.5
N$42  (via drill 3)
  other vias: 37,59.5
N$43  (via drill 3)
  other vias: 37,40.5

### Text on the board
tNames: Extended Wireless Numpad Rev 1.0 | Drawn and Designed by Bupher 4/29/2021
bNames: JLCJLCJLCJLC